# EAGLE schematic timer rtc io (EAGLE 9.6.1)
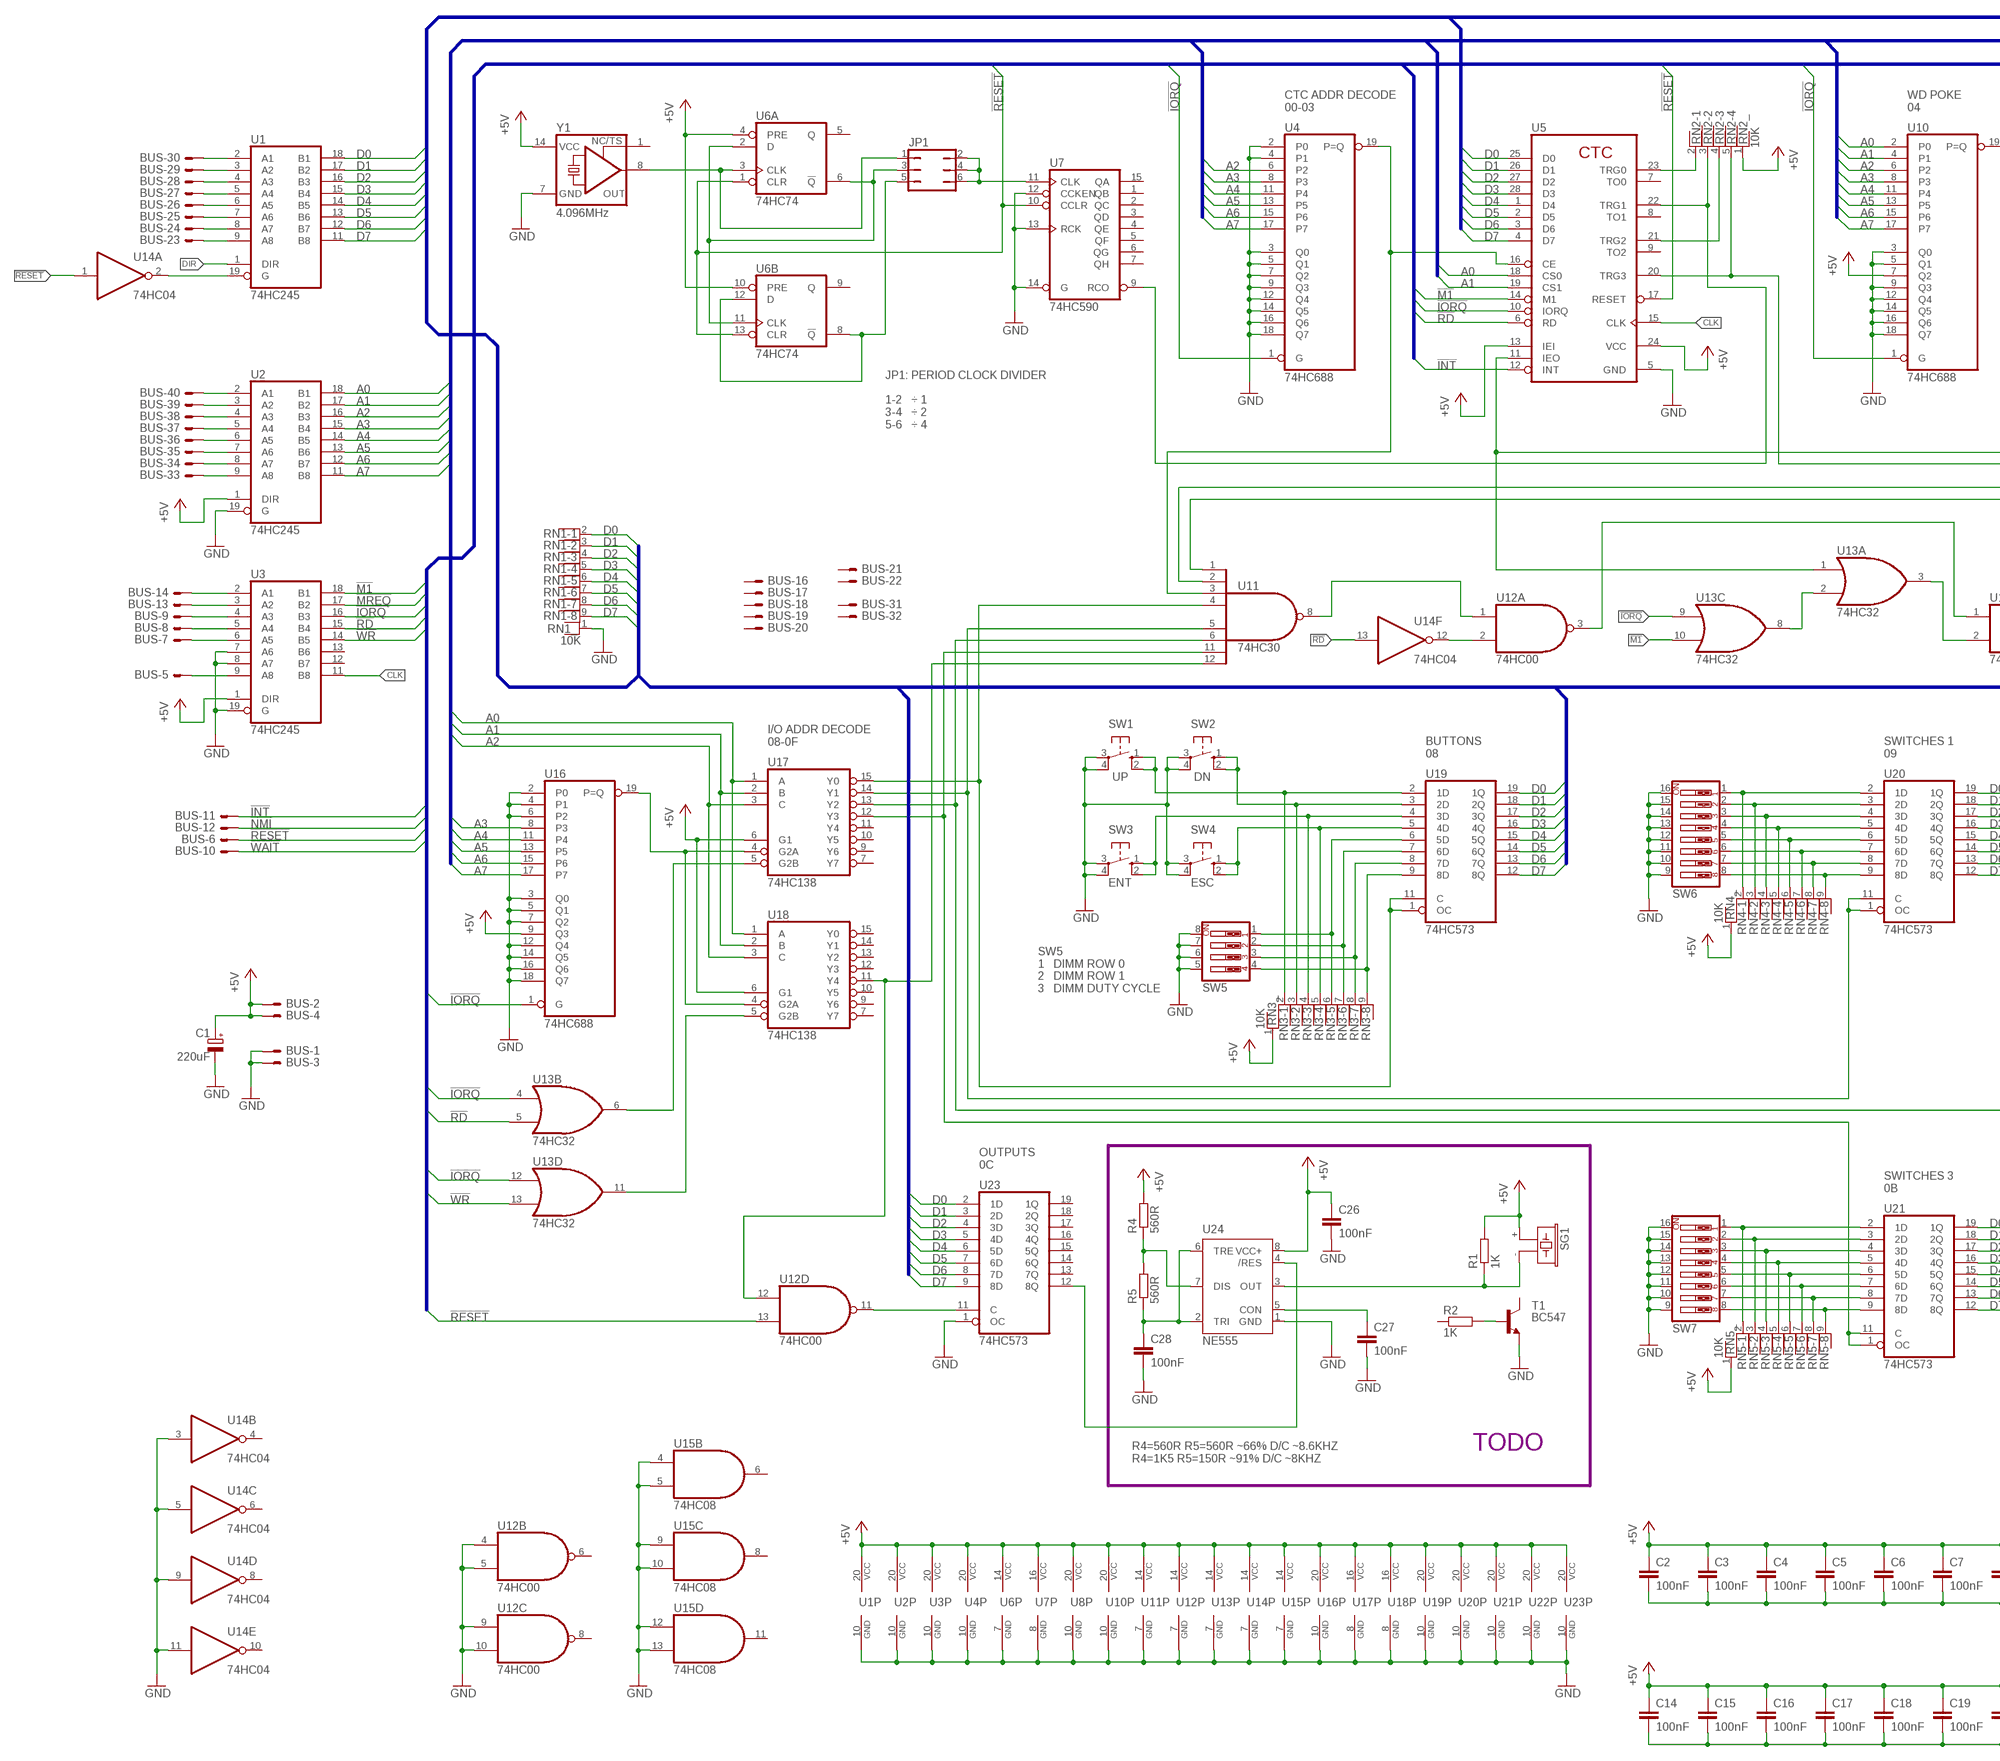
[diagram p0: schematic, sheet 1, part 1 of 2]
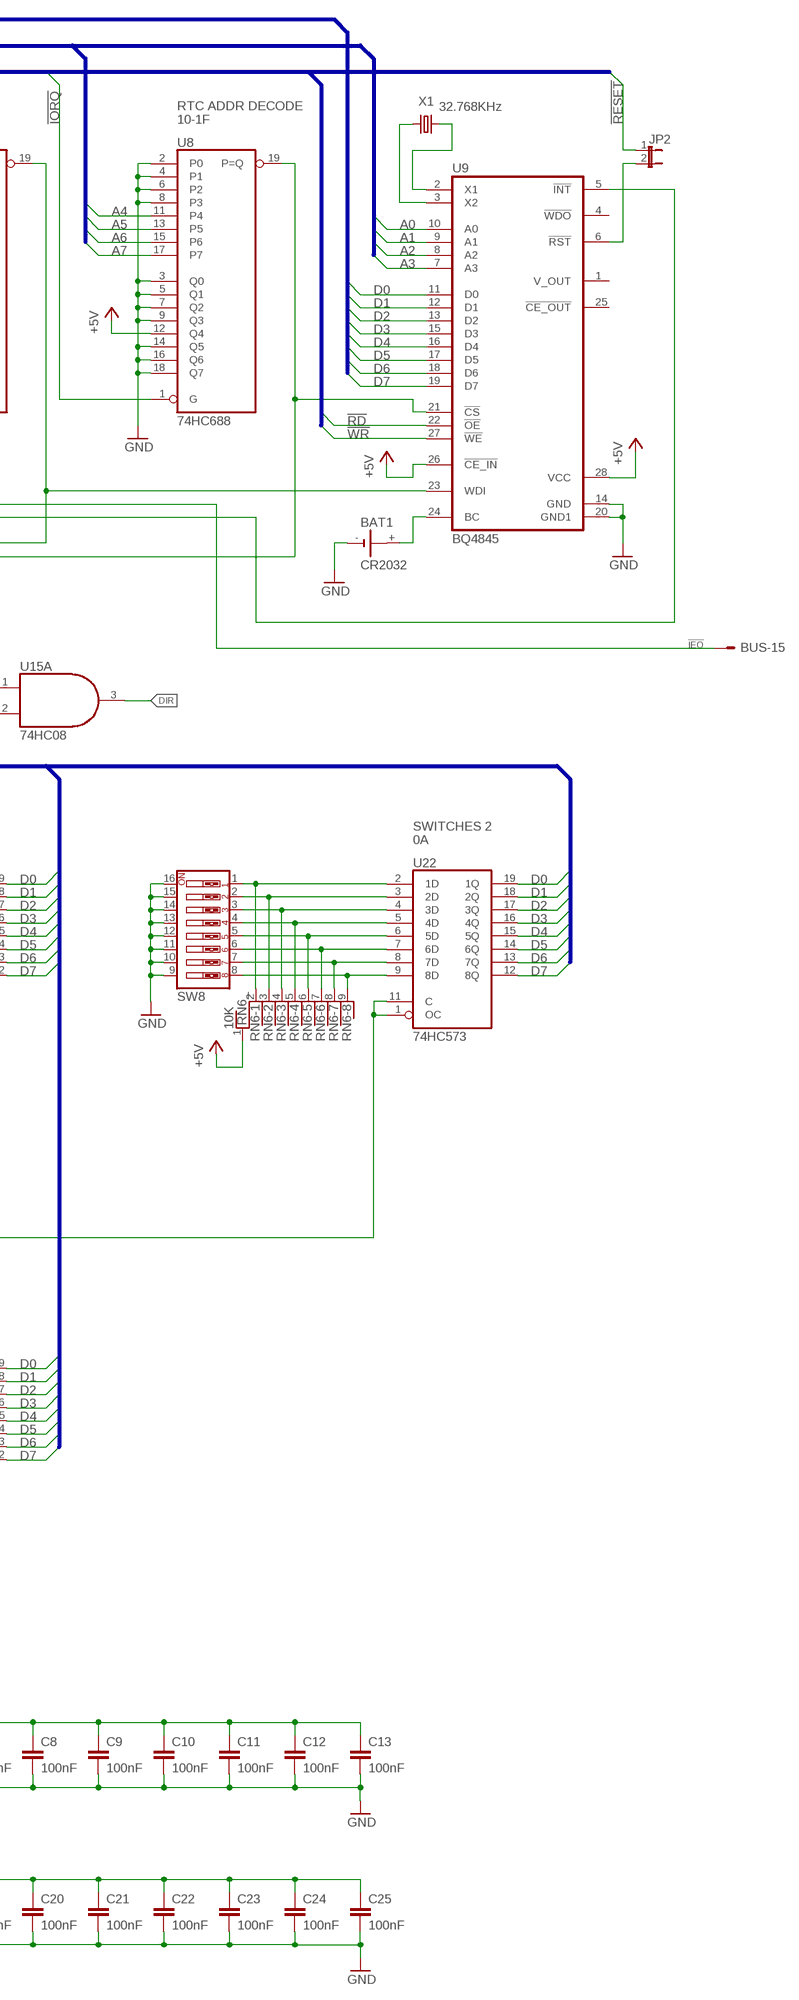
[diagram p1: schematic, sheet 1, part 2 of 2]

## Parts
BAT1  CR2032  CR2032H  [CR2032H]
BUS  ML40E  [ML40]
C1  220uF  CPOL-EUE3.5-8  [E3,5-8]
C2  100nF  C-EU050-025X075  [C050-025X075]
C3  100nF  C-EU050-025X075  [C050-025X075]
C4  100nF  C-EU050-025X075  [C050-025X075]
C5  100nF  C-EU050-025X075  [C050-025X075]
C6  100nF  C-EU050-025X075  [C050-025X075]
C7  100nF  C-EU050-025X075  [C050-025X075]
C8  100nF  C-EU050-025X075  [C050-025X075]
C9  100nF  C-EU050-025X075  [C050-025X075]
C10  100nF  C-EU050-025X075  [C050-025X075]
C11  100nF  C-EU050-025X075  [C050-025X075]
C12  100nF  C-EU050-025X075  [C050-025X075]
C13  100nF  C-EU050-025X075  [C050-025X075]
C14  100nF  C-EU050-025X075  [C050-025X075]
C15  100nF  C-EU050-025X075  [C050-025X075]
C16  100nF  C-EU050-025X075  [C050-025X075]
C17  100nF  C-EU050-025X075  [C050-025X075]
C18  100nF  C-EU050-025X075  [C050-025X075]
C19  100nF  C-EU050-025X075  [C050-025X075]
C20  100nF  C-EU050-025X075  [C050-025X075]
C21  100nF  C-EU050-025X075  [C050-025X075]
C22  100nF  C-EU050-025X075  [C050-025X075]
C23  100nF  C-EU050-025X075  [C050-025X075]
C24  100nF  C-EU050-025X075  [C050-025X075]
C25  100nF  C-EU050-025X075  [C050-025X075]
C26  100nF  C-EU050-025X075  [C050-025X075]
C27  100nF  C-EU050-025X075  [C050-025X075]
C28  100nF  C-EU050-025X075  [C050-025X075]
JP1  JP3Q  [JP3Q]
JP2  JP1E  [JP1]
R1  1K  R-EU_0207/10  [0207/10]
R2  1K  R-EU_0207/10  [0207/10]
R4  560R  R-EU_0207/10  [0207/10]
R5  560R  R-EU_0207/10  [0207/10]
RN1  10K  RNX8  [RN-9]
RN2  10K  RNX4  [RN-5]
RN3  10K  RNX8  [RN-9]
RN4  10K  RNX8  [RN-9]
RN5  10K  RNX8  [RN-9]
RN6  10K  RNX8  [RN-9]
SG1  F/CM12P  [F/CM12P]
SW1  10-XX  [B3F-10XX]
SW2  10-XX  [B3F-10XX]
SW3  10-XX  [B3F-10XX]
SW4  10-XX  [B3F-10XX]
SW5  SW_DIP-4  [EDG-04]
SW6  SW_DIP-8  [EDG-08]
SW7  SW_DIP-8  [EDG-08]
SW8  SW_DIP-8  [EDG-08]
T1  BC547  [TO92]
U1  74HC245  74LS245N  [DIL20]
U2  74HC245  74LS245N  [DIL20]
U3  74HC245  74LS245N  [DIL20]
U4  74HC688  74LS688N  [DIL20]
U5  Z80CTC  [DIL28]
U6  74HC74  74LS74N  [DIL14]
U7  74HC590  74LS590N  [DIL16]
U8  74HC688  74LS688N  [DIL20]
U9  BQ4845  BQ4845P  [DIL28-6]
U10  74HC688  74LS688N  [DIL20]
U11  74HC30  74LS30N  [DIL14]
U12  74HC00  74LS00N  [DIL14]
U13  74HC32  74LS32N  [DIL14]
U14  74HC04  74LS04N  [DIL14]
U15  74HC08  74LS08N  [DIL14]
U16  74HC688  74LS688N  [DIL20]
U17  74HC138  74LS138N  [DIL16]
U18  74HC138  74LS138N  [DIL16]
U19  74HC573  74HC573N  [DIL20]
U20  74HC573  74HC573N  [DIL20]
U21  74HC573  74HC573N  [DIL20]
U22  74HC573  74HC573N  [DIL20]
U23  74HC573  74HC573N  [DIL20]
U24  NE555  [DIL-08]
X1  32.768KHz  CRYSTALTC38H  [TC38H]
Y1  4.096MHz  XO-14  [DIL14S]

## Nets
!IEO!: BUS.15 U5.11(IEO) U13.1(A:I0)
!INT!: BUS.11 U5.12(INT)
!IORQ!: U3.16(B3) U4.1(G) U5.10(IORQ) U8.1(G) U10.1(G) U13.4(B:I0) U13.9(C:I0) U13.12(D:I0) U16.1(G)
!M1!: U3.18(B1) U5.14(M1) U13.10(C:I1)
!MREQ!: U3.17(B2)
!NMI!: BUS.12
!RD!: U3.15(B4) U5.6(RD) U9.22(!OE!) U13.5(B:I1) U14.13(F:I)
!RESET!: BUS.6 JP2.1 U5.17(RESET) U6.1(A:CLR) U6.13(B:CLR) U7.10(CCLR) U12.13(D:I1) U14.1(A:I)
!WAIT!: BUS.10
!WR!: U3.14(B5) U9.27(!WE!) U13.13(D:I1)
+5V: BUS.2 BUS.4 C1.+ C2.1 C3.1 C4.1 C5.1 C6.1 C7.1 C8.1 C9.1 C10.1 C11.1 C12.1 C13.1 C14.1 C15.1 C16.1 C17.1 C18.1 C19.1 C20.1 C21.1 C22.1 C23.1 C24.1 C25.1 C26.1 R1.2 R4.2 RN2.1 RN3.1 RN4.1 RN5.1 RN6.1 SG1.+ U1.20(VCC) U2.1(DIR) U2.20(VCC) U3.1(DIR) U3.20(VCC) U4.20(VCC) U5.13(IEI) U5.24(VCC) U6.4(A:PRE) U6.10(B:PRE) U6.14(P:VCC) U7.16(VCC) U8.12(Q4) U8.20(VCC) U9.26(!CE_IN!) U9.28(VCC) U10.7(Q2) U10.20(VCC) U11.14(VCC) U12.14(P:VCC) U13.14(P:VCC) U14.14(P:VCC) U15.14(P:VCC) U16.9(Q3) U16.20(VCC) U17.6(G1) U17.16(VCC) U18.6(G1) U18.16(VCC) U19.20(VCC) U20.20(VCC) U21.20(VCC) U22.20(VCC) U23.20(VCC) U24.8(VCC+) Y1.14(VCC)
A0: U2.18(B1) U5.18(CS0) U9.10(A0) U10.2(P0) U17.1(A) U18.1(A)
A1: U2.17(B2) U5.19(CS1) U9.9(A1) U10.4(P1) U17.2(B) U18.2(B)
A2: U2.16(B3) U4.6(P2) U9.8(A2) U10.6(P2) U17.3(C) U18.3(C)
A3: U2.15(B4) U4.8(P3) U9.7(A3) U10.8(P3) U16.8(P3)
A4: U2.14(B5) U4.11(P4) U8.11(P4) U10.11(P4) U16.11(P4)
A5: U2.13(B6) U4.13(P5) U8.13(P5) U10.13(P5) U16.13(P5)
A6: U2.12(B7) U4.15(P6) U8.15(P6) U10.15(P6) U16.15(P6)
A7: U2.11(B8) U4.17(P7) U8.17(P7) U10.17(P7) U16.17(P7)
CLK: U3.11(B8) U5.15(CLK)
D0: RN1.2 U1.18(B1) U5.25(D0) U9.11(D0) U19.19(1Q) U20.19(1Q) U21.19(1Q) U22.19(1Q) U23.2(1D)
D1: RN1.3 U1.17(B2) U5.26(D1) U9.12(D1) U19.18(2Q) U20.18(2Q) U21.18(2Q) U22.18(2Q) U23.3(2D)
D2: RN1.4 U1.16(B3) U5.27(D2) U9.13(D2) U19.17(3Q) U20.17(3Q) U21.17(3Q) U22.17(3Q) U23.4(3D)
D3: RN1.5 U1.15(B4) U5.28(D3) U9.15(D3) U19.16(4Q) U20.16(4Q) U21.16(4Q) U22.16(4Q) U23.5(4D)
D4: RN1.6 U1.14(B5) U5.1(D4) U9.16(D4) U19.15(5Q) U20.15(5Q) U21.15(5Q) U22.15(5Q) U23.6(5D)
D5: RN1.7 U1.13(B6) U5.2(D5) U9.17(D5) U19.14(6Q) U20.14(6Q) U21.14(6Q) U22.14(6Q) U23.7(6D)
D6: RN1.8 U1.12(B7) U5.3(D6) U9.18(D6) U19.13(7Q) U20.13(7Q) U21.13(7Q) U22.13(7Q) U23.8(7D)
D7: RN1.9 U1.11(B8) U5.4(D7) U9.19(D7) U19.12(8Q) U20.12(8Q) U21.12(8Q) U22.12(8Q) U23.9(8D)
DIR: U1.1(DIR) U15.3(A:O)
GND: BAT1.- BUS.1 BUS.3 C1.- C2.2 C3.2 C4.2 C5.2 C6.2 C7.2 C8.2 C9.2 C10.2 C11.2 C12.2 C13.2 C14.2 C15.2 C16.2 C17.2 C18.2 C19.2 C20.2 C21.2 C22.2 C23.2 C24.2 C25.2 C26.2 C27.2 C28.2 RN1.1 SW1.3(P) SW1.4(P1) SW2.3(P) SW2.4(P1) SW3.3(P) SW3.4(P1) SW4.3(P) SW4.4(P1) SW5.5 SW5.6 SW5.7 SW5.8 SW6.9 SW6.10 SW6.11 SW6.12 SW6.13 SW6.14 SW6.15 SW6.16 SW7.9 SW7.10 SW7.11 SW7.12 SW7.13 SW7.14 SW7.15 SW7.16 SW8.9 SW8.10 SW8.11 SW8.12 SW8.13 SW8.14 SW8.15 SW8.16 T1.1(E) U1.10(GND) U2.10(GND) U2.19(G) U3.7(A6) U3.8(A7) U3.10(GND) U3.19(G) U4.2(P0) U4.3(Q0) U4.4(P1) U4.5(Q1) U4.7(Q2) U4.9(Q3) U4.10(GND) U4.12(Q4) U4.14(Q5) U4.16(Q6) U4.18(Q7) U5.5(GND) U6.7(P:GND) U7.8(GND) U7.12(CCKEN) U7.13(RCK) U7.14(G) U8.2(P0) U8.3(Q0) U8.4(P1) U8.5(Q1) U8.6(P2) U8.7(Q2) U8.8(P3) U8.9(Q3) U8.10(GND) U8.14(Q5) U8.16(Q6) U8.18(Q7) U9.14(GND) U9.20(GND1) U10.3(Q0) U10.5(Q1) U10.9(Q3) U10.10(GND) U10.12(Q4) U10.14(Q5) U10.16(Q6) U10.18(Q7) U11.7(GND) U12.4(B:I0) U12.5(B:I1) U12.7(P:GND) U12.9(C:I0) U12.10(C:I1) U13.7(P:GND) U14.3(B:I) U14.5(C:I) U14.7(P:GND) U14.9(D:I) U14.11(E:I) U15.4(B:I0) U15.5(B:I1) U15.7(P:GND) U15.9(C:I0) U15.10(C:I1) U15.12(D:I0) U15.13(D:I1) U16.2(P0) U16.3(Q0) U16.4(P1) U16.5(Q1) U16.6(P2) U16.7(Q2) U16.10(GND) U16.12(Q4) U16.14(Q5) U16.16(Q6) U16.18(Q7) U17.8(GND) U18.8(GND) U19.10(GND) U20.10(GND) U21.10(GND) U22.10(GND) U23.1(OC) U23.10(GND) U24.1(GND) Y1.7(GND)
N$1: JP1.3 U6.2(A:D) U6.6(A:!Q) U6.11(B:CLK)
N$2: U9.2(X1) X1.1
N$3: U9.23(WDI) U10.19(P=Q) U11.2(I1)
N$4: U9.3(X2) X1.2
N$5: U8.19(P=Q) U9.21(!CS!) U11.1(I0)
N$6: BAT1.+ U9.24(BC)
N$7: U4.19(P=Q) U5.16(CE) U11.3(I2)
N$8: U12.11(D:O) U23.11(C)
N$9: U1.19(G) U14.2(A:O)
N$10: U16.19(P=Q) U17.4(G2A) U18.4(G2A)
N$11: U13.6(B:O) U17.5(G2B)
N$12: RN4.2 SW6.1 U20.2(1D)
N$13: RN4.3 SW6.2 U20.3(2D)
N$14: RN4.4 SW6.3 U20.4(3D)
N$15: RN4.5 SW6.4 U20.5(4D)
N$16: RN4.6 SW6.5 U20.6(5D)
N$17: RN4.7 SW6.6 U20.7(6D)
N$18: RN4.8 SW6.7 U20.8(7D)
N$19: RN4.9 SW6.8 U20.9(8D)
N$20: RN5.2 SW7.1 U21.2(1D)
N$21: RN5.3 SW7.2 U21.3(2D)
N$22: RN5.4 SW7.3 U21.4(3D)
N$23: RN5.5 SW7.4 U21.5(4D)
N$24: RN5.6 SW7.5 U21.6(5D)
N$25: RN5.7 SW7.6 U21.7(6D)
N$26: RN5.8 SW7.7 U21.8(7D)
N$27: RN5.9 SW7.8 U21.9(8D)
N$28: RN6.2 SW8.1 U22.2(1D)
N$29: RN6.3 SW8.2 U22.3(2D)
N$30: RN6.4 SW8.3 U22.4(3D)
N$31: RN6.5 SW8.4 U22.5(4D)
N$32: RN6.6 SW8.5 U22.6(5D)
N$33: RN6.7 SW8.6 U22.7(6D)
N$34: RN6.8 SW8.7 U22.8(7D)
N$35: RN6.9 SW8.8 U22.9(8D)
N$36: U11.8(O) U12.1(A:I0)
N$37: RN3.2 SW1.1(S) SW1.2(S1) U19.2(1D)
N$38: RN3.3 SW2.1(S) SW2.2(S1) U19.3(2D)
N$39: RN3.4 SW3.1(S) SW3.2(S1) U19.4(3D)
N$40: RN3.5 SW4.1(S) SW4.2(S1) U19.5(4D)
N$41: RN3.6 SW5.1 U19.6(5D)
N$42: RN3.7 SW5.2 U19.7(6D)
N$43: RN3.8 SW5.3 U19.8(7D)
N$44: RN3.9 SW5.4 U19.9(8D)
N$45: U11.4(I3) U17.15(Y0) U19.1(OC) U19.11(C)
N$46: U11.5(I4) U17.14(Y1) U20.1(OC) U20.11(C)
N$47: U11.6(I5) U17.13(Y2) U22.1(OC) U22.11(C)
N$48: U13.3(A:O) U15.2(A:I1)
N$49: BUS.23 U1.9(A8)
N$50: RN2.4 U5.21(TRG2)
N$51: U12.2(A:I1) U14.12(F:O)
N$52: U13.11(D:O) U18.5(G2B)
N$53: JP2.2 U9.6(!RST!)
N$54: U11.12(I7) U12.12(D:I0) U18.11(Y4)
N$55: C27.1 U24.5(CON)
N$56: U23.12(8Q) U24.4(/RES)
N$57: JP1.1 U6.3(A:CLK) Y1.8(OUT)
N$58: JP1.5 U6.8(B:!Q) U6.12(B:D)
N$59: RN2.3 U5.22(TRG1) U7.9(RCO)
N$60: R1.1 SG1.- U24.3(OUT)
N$62: RN2.5 U5.20(TRG3) U9.5(!INT!)
N$63: JP1.2 JP1.4 JP1.6 U7.11(CLK)
N$64: RN2.2 U5.23(TRG0)
N$65: BUS.24 U1.8(A7)
N$66: BUS.25 U1.7(A6)
N$67: BUS.26 U1.6(A5)
N$68: BUS.27 U1.5(A4)
N$69: BUS.28 U1.4(A3)
N$70: BUS.29 U1.3(A2)
N$71: BUS.30 U1.2(A1)
N$72: BUS.33 U2.9(A8)
N$73: BUS.34 U2.8(A7)
N$74: BUS.35 U2.7(A6)
N$75: BUS.36 U2.6(A5)
N$76: BUS.37 U2.5(A4)
N$77: BUS.38 U2.4(A3)
N$78: BUS.39 U2.3(A2)
N$79: BUS.40 U2.2(A1)
N$80: BUS.14 U3.2(A1)
N$81: BUS.13 U3.3(A2)
N$82: BUS.9 U3.4(A3)
N$83: BUS.8 U3.5(A4)
N$84: BUS.7 U3.6(A5)
N$85: BUS.5 U3.9(A8)
N$86: R2.2 T1.2(B)
N$87: U12.3(A:O) U15.1(A:I0)
N$88: R4.1 R5.2 U24.7(DIS)
N$89: C28.1 R5.1 U24.2(TRI) U24.6(TRE)
N$90: U11.11(I6) U17.12(Y3) U21.1(OC) U21.11(C)
N$91: U13.2(A:I1) U13.8(C:O)
Unconnected: BAT1.+@1(+) BUS.16 BUS.17 BUS.18 BUS.19 BUS.20 BUS.21 BUS.22 BUS.31 BUS.32 R2.1 T1.3(C) U3.12(B7) U3.13(B6) U5.7(TO0) U5.8(TO1) U5.9(TO2) U6.5(A:Q) U6.9(B:Q) U7.1(QB) U7.2(QC) U7.3(QD) U7.4(QE) U7.5(QF) U7.6(QG) U7.7(QH) U7.15(QA) U9.1(V_OUT) U9.4(!WDO!) U9.25(!CE_OUT!) U12.6(B:O) U12.8(C:O) U14.4(B:O) U14.6(C:O) U14.8(D:O) U14.10(E:O) U15.6(B:O) U15.8(C:O) U15.11(D:O) U17.7(Y7) U17.9(Y6) U17.10(Y5) U17.11(Y4) U18.7(Y7) U18.9(Y6) U18.10(Y5) U18.12(Y3) U18.13(Y2) U18.14(Y1) U18.15(Y0) U23.13(7Q) U23.14(6Q) U23.15(5Q) U23.16(4Q) U23.17(3Q) U23.18(2Q) U23.19(1Q) Y1.1(TS)

## Buses
Z80DATA:D[0..7]
Z80ADDRESS:A[0..15]
Z80CONTROL:!BUSAK!,!BUSRQ!,!HALT!,!INT!,!IORQ!,!M1!,!MREQ!,!NMI!,!RD!,!RESET!,!RFSH!,!WAIT!,!WR!

## Notes on the sheet
- CTC ADDR DECODE
  00-03
- WD POKE
  04
- RTC ADDR DECODE
  10-1F
- JP1: PERIOD CLOCK DIVIDER
  
  1-2   ÷ 1
  3-4   ÷ 2
  5-6   ÷ 4
- I/O ADDR DECODE
  08-0F
- BUTTONS
  08
- SWITCHES 1
  09
- SWITCHES 2
  0A
- UP | DN
- ENT | ESC
- SW5
  1   DIMM ROW 0
  2   DIMM ROW 1
  3   DIMM DUTY CYCLE
- OUTPUTS
  0C
- SWITCHES 3
  0B
- TODO
- R4=560R R5=560R ~66% D/C ~8.6KHZ
  R4=1K5 R5=150R ~91% D/C ~8KHZ

## Library data of the parts
BAT1 = battery:CR2032H: LI BATTERY Varta
BUS = con-ml:ML40E: HARTING; OC_FARNELL: unknown; OC_NEWARK: unknown
C1 = rcl:CPOL-EU: POLARIZED CAPACITOR, European symbol
C2-C28 = rcl:C-EU: CAPACITOR, European symbol
JP1 = jumper:JP3Q: JUMPER
JP2 = jumper:JP1E: JUMPER
R1 R2 R4 R5 = rcl:R-EU_: RESISTOR, European symbol
RN1 RN3-RN6 = resistor-net:RNX8: RESISTOR NETWORK; OC_FARNELL: unknown; OC_NEWARK: unknown
RN2 = resistor-net:RNX4: RESISTOR NETWORK; OC_FARNELL: unknown; OC_NEWARK: unknown
SG1 = buzzer:F/CM12P: BUZZER Source: Buerklin; OC_FARNELL: unknown; OC_NEWARK: unknown
SW1-SW4 = switch-omron:10-XX: OMRON SWITCH; MPN: B3F-1000; OC_FARNELL: 176432; OC_NEWARK: 36M3542
SW5 = special:SW_DIP-4: DIP SWITCH
SW6-SW8 = special:SW_DIP-8: DIP SWITCH
T1 = transistor:BC547: NPN TRANSISTOR
U1-U3 = 74xx-us:74*245: Octal BUS TRANSCEIVER, 3-state
U4 U8 U10 U16 = 74xx-us:74*688: 8-bit MAGNITUDE/IDENTITY COMPARATOR, totem pole
U5 = zilog:Z80CTC: Z80 FAMILY DEVICE
U6 = 74xx-us:74*74: Dual D type positive edge triggered FLIP FLOP, preset and clear
U7 = 74xx-us:74*590: 8-bit binary COUNTER, output register
U9 = Z80 clock:BQ4845
U11 = 74xx-us:74*30: 8-input NAND gate
U12 = 74xx-us:74*00: Quad 2-input NAND gate
U13 = 74xx-us:74*32: Quad 2-input OR gate
U14 = 74xx-us:74*04: Hex INVERTER
U15 = 74xx-us:74*08: Quad 2-input AND gate
U17 U18 = 74xx-us:74*138: 3-line to 8-line DECODER/DEMULTIPLEXER
U19-U23 = 74xx-us:74*573: 8-bit D latch BUS DRIVER
U24 = st-microelectronics:NE555: General purpose bipolar Timer; MF: Arrow Electronics; MPN: NE555N; OC_FARNELL: 1467742; OC_NEWARK: 89K1486
X1 = crystal:CRYSTAL: CRYSTAL; OC_FARNELL: unknown; OC_NEWARK: unknown
Y1 = crystal:XO-: CRYSTAL; OC_FARNELL: unknown; OC_NEWARK: unknown